# Altium project 22_exp_21_09_06.PrjPcb
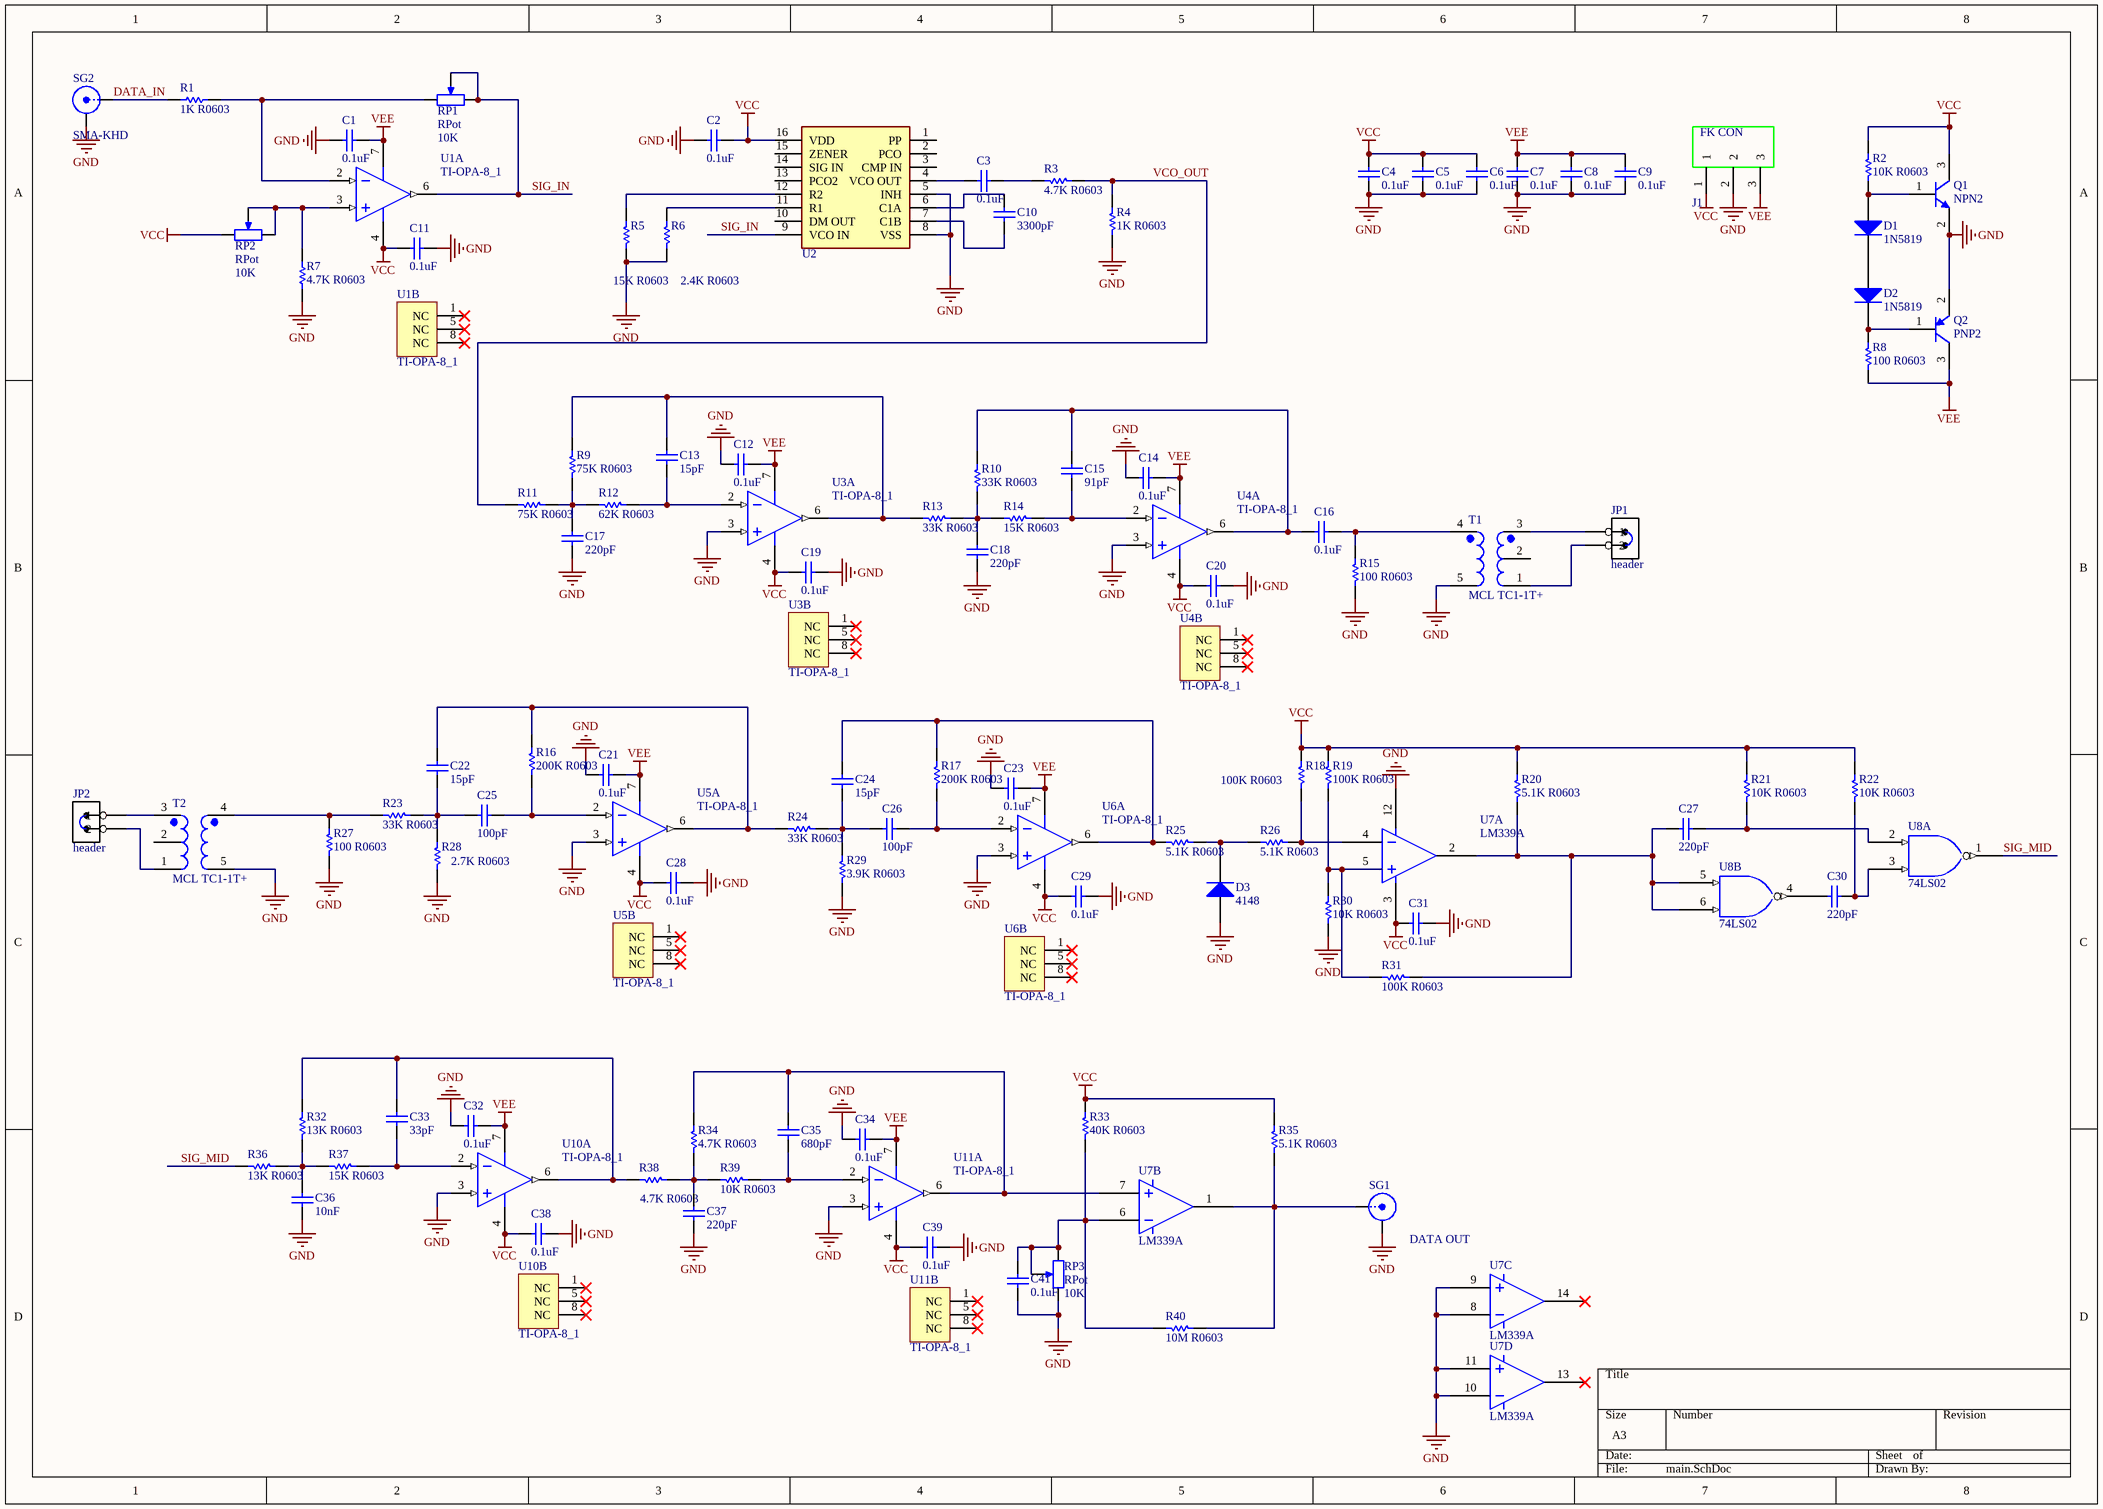
[diagram p0: main.SchDoc]
1 sheet, 105 parts. Net scope: global (net labels, ports and power ports of the same name join across sheets).
Board file: main_pcb.PcbDoc

## Sheet main.SchDoc
size A3

### Parts
C1  0.1uF  [0603_C]
C2  0.1uF  [0603_C]
C3  0.1uF  [0603_C]
C4  0.1uF  [0603_C]
C5  0.1uF  [0603_C]
C6  0.1uF  [0603_C]
C7  0.1uF  [0603_C]
C8  0.1uF  [0603_C]
C9  0.1uF  [0603_C]
C10  3300pF  [0603_C]
C11  0.1uF  [0603_C]
C12  0.1uF  [0603_C]
C13  15pF  [0603_C]
C14  0.1uF  [0603_C]
C15  91pF  [0603_C]
C16  0.1uF  [0603_C]
C17  220pF  [0603_C]
C18  220pF  [0603_C]
C19  0.1uF  [0603_C]
C20  0.1uF  [0603_C]
C21  0.1uF  [0603_C]
C22  15pF  [0603_C]
C23  0.1uF  [0603_C]
C24  15pF  [0603_C]
C25  100pF  [0603_C]
C26  100pF  [0603_C]
C27  220pF  [0603_C]
C28  0.1uF  [0603_C]
C29  0.1uF  [0603_C]
C30  220pF  [0603_C]
C31  0.1uF  [0603_C]
C32  0.1uF  [0603_C]
C33  33pF  [0603_C]
C34  0.1uF  [0603_C]
C35  680pF  [0603_C]
C36  10nF  [0603_C]
C37  220pF  [0603_C]
C38  0.1uF  [0603_C]
C39  0.1uF  [0603_C]
C41  0.1uF  [0603_C]
D1  1N5819  [SOD123]
D2  1N5819  [SOD123]
D3  4148  [DIODE_SOIC]
J1  FK_CONN_3PIN  [FK_CONN_3pin]  (value not drawn)
JP1  header  [header2]
JP2  header  [header2]
Q1  NPN2  [SOT-23-3]
Q2  PNP2  [SOT-23-3]
R1  1K R0603  [0603_R]
R2  10K R0603  [0603_R]
R3  4.7K R0603  [0603_R]
R4  1K R0603  [0603_R]
R5  15K R0603  [0603_R]
R6  2.4K R0603  [0603_R]
R7  4.7K R0603  [0603_R]
R8  100 R0603  [0603_R]
R9  75K R0603  [0603_R]
R10  33K R0603  [0603_R]
R11  75K R0603  [0603_R]
R12  62K R0603  [0603_R]
R13  33K R0603  [0603_R]
R14  15K R0603  [0603_R]
R15  100 R0603  [0603_R]
R16  200K R0603  [0603_R]
R17  200K R0603  [0603_R]
R18  100K R0603  [0603_R]
R19  100K R0603  [0603_R]
R20  5.1K R0603  [0603_R]
R21  10K R0603  [0603_R]
R22  10K R0603  [0603_R]
R23  33K R0603  [0603_R]
R24  33K R0603  [0603_R]
R25  5.1K R0603  [0603_R]
R26  5.1K R0603  [0603_R]
R27  100 R0603  [0603_R]
R28  2.7K R0603  [0603_R]
R29  3.9K R0603  [0603_R]
R30  10K R0603  [0603_R]
R31  100K R0603  [0603_R]
R32  13K R0603  [0603_R]
R33  40K R0603  [0603_R]
R34  4.7K R0603  [0603_R]
R35  5.1K R0603  [0603_R]
R36  13K R0603  [0603_R]
R37  15K R0603  [0603_R]
R38  4.7K R0603  [0603_R]
R39  10K R0603  [0603_R]
R40  10M R0603  [0603_R]
RP1  RPot  value 10K  [RPot]
RP2  RPot  value 10K  [RPot]
RP3  RPot  value 10K  [RPot]
SG1  DATA OUT  [SMA-2]
SG2  SMA-KHD  [SMA-2]
T1  MCL TC1-1T+  [TC1-1T]
T2  MCL TC1-1T+  [TC1-1T]
U1  TI-OPA-8_1  [SOIC-8]  (parts A,B of 2)
U2  cd4046  [SOIC-16]  (value not drawn)
U3  TI-OPA-8_1  [SOIC-8]  (parts A,B of 2)
U4  TI-OPA-8_1  [SOIC-8]  (parts A,B of 2)
U5  TI-OPA-8_1  [SOIC-8]  (parts A,B of 2)
U6  TI-OPA-8_1  [SOIC-8]  (parts A,B of 2)
U7  LM339A  [SOIC-14]  (parts A,B,C,D of 4)
U8  74LS02  [SOIC-14]  (parts A,B of 4)
U10  TI-OPA-8_1  [SOIC-8]  (parts A,B of 2)
U11  TI-OPA-8_1  [SOIC-8]  (parts A,B of 2)

### Nets
GND: C1.1 C2.1 C4.2 C5.2 C6.2 C7.2 C8.2 C9.2 C11.2 C12.1 C14.1 C17.1 C18.1 C19.2 C20.2 C21.1 C23.1 C28.2 C29.2 C31.2 C32.1 C34.1 C36.1 C37.1 C38.2 C39.2 C41.1 D3.1(A) J1.2 Q1.2(E) Q2.2(E) R4.2 R5.1 R6.1 R7.1 R15.2 R27.2 R28.2 R29.2 R30.2 RP3.3(BOT) SG1.1(Y) SG2.1(Y) T1.5 T2.5 U2.5(INH) U2.8(VSS) U3.3(IN+) U4.3(IN+) U5.3(IN+) U6.3(IN+) U7.8 U7.9 U7.10 U7.11 U7.12 U10.3(IN+) U11.3(IN+)
VCC: C2.2 C4.1 C5.1 C6.1 C11.1 C19.1 C20.1 C28.1 C29.1 C31.1 C38.1 C39.1 J1.1 Q1.3(C) R2.1 R18.1 R19.1 R20.1 R21.1 R22.1 R33.1 R35.1 RP2.3(BOT) U1.4(V-) U2.16(VDD) U3.4(V-) U4.4(V-) U5.4(V-) U6.4(V-) U7.3 U10.4(V-) U11.4(V-)
VEE: C1.2 C7.1 C8.1 C9.1 C12.2 C14.2 C21.2 C23.2 C32.2 C34.2 J1.3 Q2.3(C) R8.2 U1.7(V+) U3.7(V+) U4.7(V+) U5.7(V+) U6.7(V+) U10.7(V+) U11.7(V+)
DATA_IN: R1.1 SG2.2(X)
SIG_IN: RP1.1(TOP) RP1.2(TAP) U1.6(OUT) U2.9(VCO_IN)
SIG_MID: R36.2 U8.1
VCO_OUT: R3.1 R4.1 R11.2
NetC3_1: C3.1 R3.2
NetC3_2: C3.2 U2.4(VCO_OUT)
NetC10_1: C10.1 U2.7(C1B)
NetC10_2: C10.2 U2.6(C1A)
NetC13_1: C13.1 R12.1 U3.2(IN-)
NetC13_2: C13.2 R9.1 R13.2 U3.6(OUT)
NetC15_1: C15.1 R14.1 U4.2(IN-)
NetC15_2: C15.2 C16.1 R10.1 U4.6(OUT)
NetC16_2: C16.2 R15.1 T1.4
NetC17_2: C17.2 R9.2 R11.1 R12.2
NetC18_2: C18.2 R10.2 R13.1 R14.2
NetC22_1: C22.1 C25.2 R23.1 R28.1
NetC22_2: C22.2 R16.1 R24.2 U5.6(OUT)
NetC24_1: C24.1 C26.2 R24.1 R29.1
NetC24_2: C24.2 R17.1 R25.2 U6.6(OUT)
NetC25_1: C25.1 R16.2 U5.2(IN-)
NetC26_1: C26.1 R17.2 U6.2(IN-)
NetC27_1: C27.1 R20.2 R31.2 U7.2 U8.5 U8.6
NetC27_2: C27.2 R21.2 U8.2
NetC30_1: C30.1 U8.4
NetC30_2: C30.2 R22.2 U8.3
NetC33_1: C33.1 R37.1 U10.2(IN-)
NetC33_2: C33.2 R32.1 R38.2 U10.6(OUT)
NetC35_1: C35.1 R39.1 U11.2(IN-)
NetC35_2: C35.2 R34.1 U7.7 U11.6(OUT)
NetC36_2: C36.2 R32.2 R36.1 R37.2
NetC37_2: C37.2 R34.2 R38.1 R39.2
NetC41_2: C41.2 R33.2 R40.1 RP3.1(TOP) RP3.2(TAP) U7.6
NetD1_1: D1.1(A) Q1.1(B) R2.2
NetD1_2: D1.2(K) D2.1(A)
NetD2_2: D2.2(K) Q2.1(B) R8.1
NetD3_2: D3.2(K) R25.1 R26.2
NetJP1_1: JP1.1 T1.3
NetJP1_2: JP1.2 T1.1
NetJP2_1: JP2.1 T2.3
NetJP2_2: JP2.2 T2.1
NetR1_2: R1.2 RP1.3(BOT) U1.2(IN-)
NetR5_2: R5.2 U2.12(R2)
NetR6_2: R6.2 U2.11(R1)
NetR7_2: R7.2 RP2.1(TOP) RP2.2(TAP) U1.3(IN+)
NetR18_2: R18.2 R26.1 U7.4
NetR19_2: R19.2 R30.1 R31.1 U7.5
NetR23_2: R23.2 R27.1 T2.4
NetR35_2: R35.2 R40.2 SG1.2(X) U7.1

Not connected (* = marked no-connect by the designer): T1 2; T2 2; U1 1(NC)* 5(NC)* 8(NC)*; U2 1(PP) 2(PCO) 3(CMP_IN) 10(DM_OUT) 13(PCO2) 14(SIG_IN) 15(ZENER); U3 1(NC)* 5(NC)* 8(NC)*; U4 1(NC)* 5(NC)* 8(NC)*; U5 1(NC)* 5(NC)* 8(NC)*; U6 1(NC)* 5(NC)* 8(NC)*; U7 13* 14*; U10 1(NC)* 5(NC)* 8(NC)*; U11 1(NC)* 5(NC)* 8(NC)*

### Notes on the sheet
- (in symbol FK_CONN_3PIN) FK CON

### Library data of the parts
C1-C39 C41 = CAP: Capacitor; Value: 104; Published: 8-Jun-2000; LatestRevisionDate: 17-Jul-2002; LatestRevisionNote: Re-released for DXP Platform.; PackageReference: RAD-0.3; Publisher: Altium Limited
D1 D2 = 1N5819: 40V 1A PEAK 25a
D3 = 1N4148: High Conductance Fast Diode; Published: 8-Jun-2000; LatestRevisionDate: 17-Jul-2002; LatestRevisionNote: Re-released for DXP Platform.; DatasheetDocument: 1997; PackageReference: DO-35; Publisher: Altium Limited; Code_JEDEC: DO-204-AH; ComponentLink1Description: Manufacturer Link; ComponentLink1URL: http://www.fairchildsemi.com/; ComponentLink2Description: Datasheet; ComponentLink2URL: http://www.fairchildsemi.com/ds/1N%2F1N4448.pdf
JP1 JP2 = HEADER 2
Q1 = NPN2: 贴片
Q2 = PNP2: 贴片; Published: 8-Jun-2000; LatestRevisionDate: 17-Jul-2002; LatestRevisionNote: Re-released for DXP Platform.; PackageReference: SOT-23B; Publisher: Altium Limited; Code_JEDEC: SOT-23
R1 R4 = RES: Resistor; Published: 8-Jun-2000; Revision: July-2002: Re-released for DXP Platform.; Publisher: Altium Limited; Value: 1K
R2 R3 R5-R40 = RES: Resistor; Value: 1K; Published: 8-Jun-2000; Revision: July-2002: Re-released for DXP Platform.; Publisher: Altium Limited
RP1-RP3 = RPot: Potentiometer; Sim Note: Enter the Resistance value and the set point into parameter fields.; Set Position: 0.5; Published: 8-Jun-2000; LatestRevisionDate: 17-Jul-2002; LatestRevisionNote: Re-released for DXP Platform.; PackageReference: VR5; Publisher: Altium Limited
SG1 SG2 = SMA_KHD
T1 T2 = TC1-1T+